# EAGLE design memext (EAGLE 6.1)
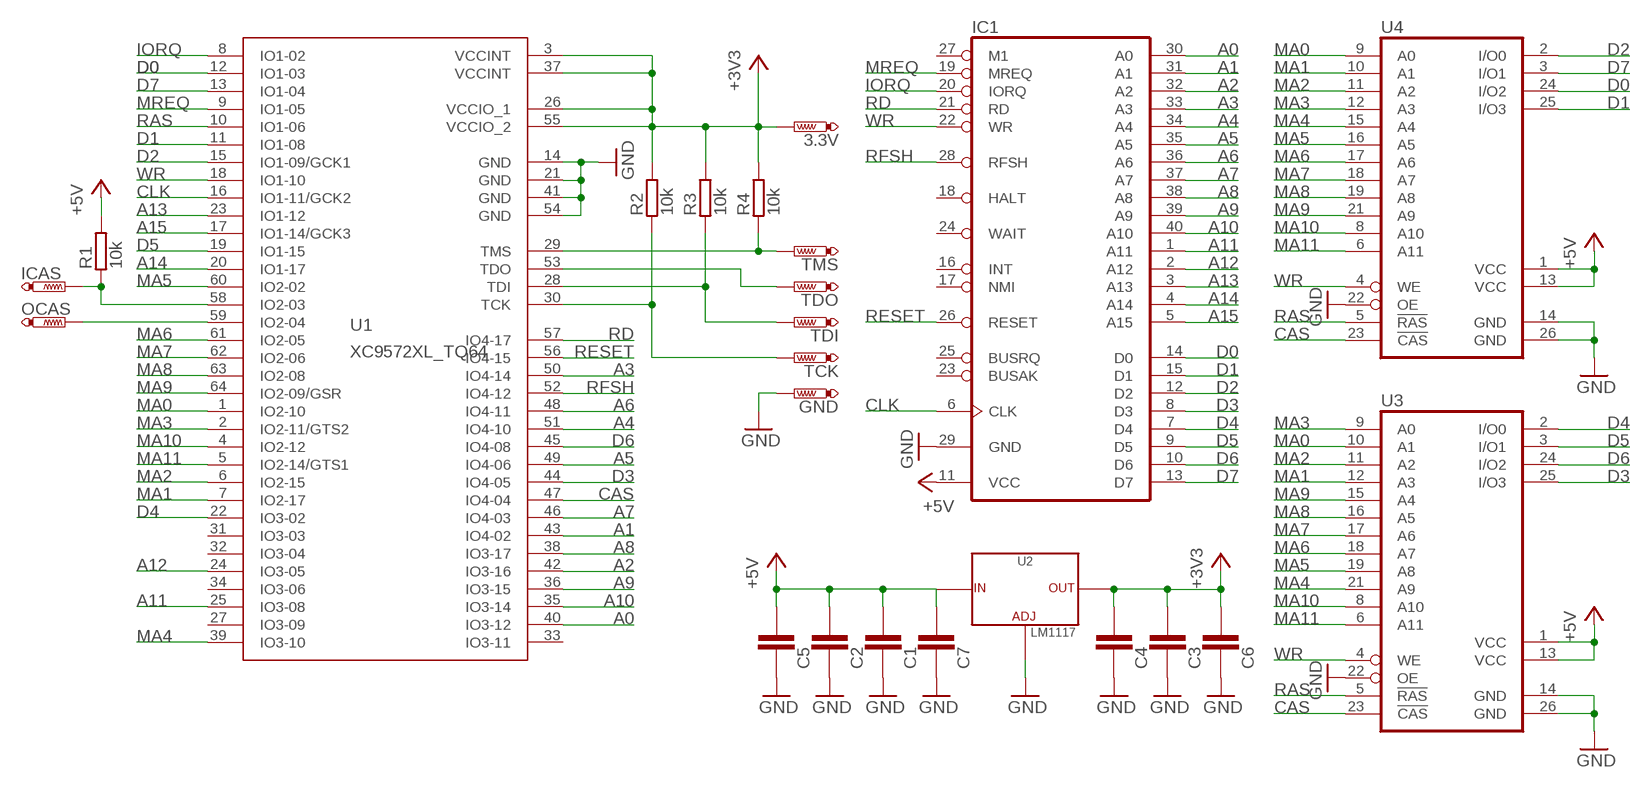
[diagram p0: schematic, sheet 1]

## Parts
3.3V  PTR1TP15SQ  [TP15SQ]
C1  KONDENZATORYC0603  [0603]
C2  KONDENZATORYC0603  [0603]
C3  KONDENZATORYC0603  [0603]
C4  KONDENZATORYC0603  [0603]
C5  KONDENZATORYC0603  [0603]
C6  KONDENZATORYC0603  [0603]
C7  KONDENZATORYC0603  [0603]
GND  PTR1TP15SQ  [TP15SQ]
IC1  Z80CPU  [DIL40]
ICAS  PTR1TP15SQ  [TP15SQ]
OCAS  PTR1TP15SQ  [TP15SQ]
R1  10k  ODPORYR0603  [0603]
R2  10k  ODPORYR0603  [0603]
R3  10k  ODPORYR0603  [0603]
R4  10k  ODPORYR0603  [0603]
TCK  PTR1TP15SQ  [TP15SQ]
TDI  PTR1TP15SQ  [TP15SQ]
TDO  PTR1TP15SQ  [TP15SQ]
TMS  PTR1TP15SQ  [TP15SQ]
U1  XC9572XL_TQ64  [TQ-64]
U2  LM1117  [SOT-223]
U3  DRAM4X4  [SOJ26-24]
U4  DRAM4X4  [SOJ26-24]

## Nets
+3V3: 3.3V.TP C3.2 C4.2 C6.2 R2.2 R3.2 R4.2 U1.3(VCCINT) U1.26(VCCIO_1) U1.37(VCCINT) U1.55(VCCIO_2) U2.2(OUT) U2.4(OUT)
+5V: C1.2 C2.2 C5.2 C7.2 IC1.11(VCC) R1.2 U2.3(IN) U3.1(VCC) U3.13(VCC) U4.1(VCC) U4.13(VCC)
A0: IC1.30(A0) U1.40(IO3-12)
A1: IC1.31(A1) U1.43(IO4-02)
A2: IC1.32(A2) U1.42(IO3-16)
A3: IC1.33(A3) U1.50(IO4-14)
A4: IC1.34(A4) U1.51(IO4-10)
A5: IC1.35(A5) U1.49(IO4-06)
A6: IC1.36(A6) U1.48(IO4-11)
A7: IC1.37(A7) U1.46(IO4-03)
A8: IC1.38(A8) U1.38(IO3-17)
A9: IC1.39(A9) U1.36(IO3-15)
A10: IC1.40(A10) U1.35(IO3-14)
A11: IC1.1(A11) U1.25(IO3-08)
A12: IC1.2(A12) U1.24(IO3-05)
A13: IC1.3(A13) U1.23(IO1-12)
A14: IC1.4(A14) U1.20(IO1-17)
A15: IC1.5(A15) U1.17(IO1-14/GCK3)
CAS: U1.47(IO4-04) U3.23(!CAS) U4.23(!CAS)
CLK: IC1.6(CLK) U1.16(IO1-11/GCK2)
D0: IC1.14(D0) U1.12(IO1-03) U4.24(I/O2)
D1: IC1.15(D1) U1.11(IO1-08) U4.25(I/O3)
D2: IC1.12(D2) U1.15(IO1-09/GCK1) U4.2(I/O0)
D3: IC1.8(D3) U1.44(IO4-05) U3.25(I/O3)
D4: IC1.7(D4) U1.22(IO3-02) U3.2(I/O0)
D5: IC1.9(D5) U1.19(IO1-15) U3.3(I/O1)
D6: IC1.10(D6) U1.45(IO4-08) U3.24(I/O2)
D7: IC1.13(D7) U1.13(IO1-04) U4.3(I/O1)
GND: C1.1 C2.1 C3.1 C4.1 C5.1 C6.1 C7.1 GND.TP IC1.29(GND) U1.14(GND) U1.21(GND) U1.41(GND) U1.54(GND) U2.1(ADJ) U3.14(GND) U3.22(OE) U3.26(GND) U4.14(GND) U4.22(OE) U4.26(GND)
IORQ: IC1.20(IORQ) U1.8(IO1-02)
MA0: U1.1(IO2-10) U3.10(A1) U4.9(A0)
MA1: U1.7(IO2-17) U3.12(A3) U4.10(A1)
MA2: U1.6(IO2-15) U3.11(A2) U4.11(A2)
MA3: U1.2(IO2-11/GTS2) U3.9(A0) U4.12(A3)
MA4: U1.39(IO3-10) U3.21(A9) U4.15(A4)
MA5: U1.60(IO2-02) U3.19(A8) U4.16(A5)
MA6: U1.61(IO2-05) U3.18(A7) U4.17(A6)
MA7: U1.62(IO2-06) U3.17(A6) U4.18(A7)
MA8: U1.63(IO2-08) U3.16(A5) U4.19(A8)
MA9: U1.64(IO2-09/GSR) U3.15(A4) U4.21(A9)
MA10: U1.4(IO2-12) U3.8(A10) U4.8(A10)
MA11: U1.5(IO2-14/GTS1) U3.6(A11) U4.6(A11)
MREQ: IC1.19(MREQ) U1.9(IO1-05)
N$1: R4.1 TMS.TP U1.29(TMS)
N$2: TDO.TP U1.53(TDO)
N$3: R3.1 TDI.TP U1.28(TDI)
N$4: R2.1 TCK.TP U1.30(TCK)
RAS: U1.10(IO1-06) U3.5(!RAS) U4.5(!RAS)
RD: IC1.21(RD) U1.57(IO4-17)
RESET: IC1.26(RESET) U1.56(IO4-15)
RFSH: IC1.28(RFSH) U1.52(IO4-12)
TP1: ICAS.TP R1.1 U1.58(IO2-03)
TP2: OCAS.TP U1.59(IO2-04)
WR: IC1.22(WR) U1.18(IO1-10) U3.4(WE) U4.4(WE)
Unconnected: IC1.16(INT) IC1.17(NMI) IC1.18(HALT) IC1.23(BUSAK) IC1.24(WAIT) IC1.25(BUSRQ) IC1.27(M1) U1.27(IO3-09) U1.31(IO3-03) U1.32(IO3-04) U1.33(IO3-11) U1.34(IO3-06)

## Library data of the parts
3.3V GND ICAS OCAS TCK TDI TDO TMS = testpad:PTR1: TEST PIN
C1-C7 = RCL:KONDENZATORY: Capacitor in package 0603 01005 (0402 metric): 0.4 × 0.2 mm (0.016 × 0.0079 in). 0.031 watt 0201 (0603 metric): 0.6 × 0.3 mm (0.024 × 0.012 in). 0.05 watt 0402 (1005 metric): 1.0 × 0.5 mm (0.039 × 0.020 in). 0.062 watt 0603 (1608 metric): 1.6 × 0.8 mm (0.063 × 0.031 in). 0.1 watt 0805 (2012 metric): 2.0 × 1.25 mm (0.079 × 0.049 in). 0.125 watt 1206 (3216 metric): 3.2 × 1.6 mm (0.13 × 0.063 in). 0.25 watt 1210 (3225 metric): 3.2 × 2.5 mm (0.13 × 0.098 in). 0.5 watt 1812 (4532 metric): 4.5 × 3.2 mm (0.18 × 0.13 in). 0.75 watt 2010 (5025 metric): 5.0 × 2.5 mm (0.20 × 0.098 in). 0.75 watt 2512 (6432 metric): 6.4 × 3.2 mm (0.25 × 0.13 in). 1 watt
IC1 = memext:Z80CPU: Z80 FAMILY DEVICE
R1-R4 = RCL:ODPORY: Resistor
U1 = memext:XC9572XL_TQ64
U2 = LM1117:LM1117: LDO
U3 U4 = memext:DRAM4X4: MEMORY; OC_FARNELL: unknown; OC_NEWARK: unknown

## Board
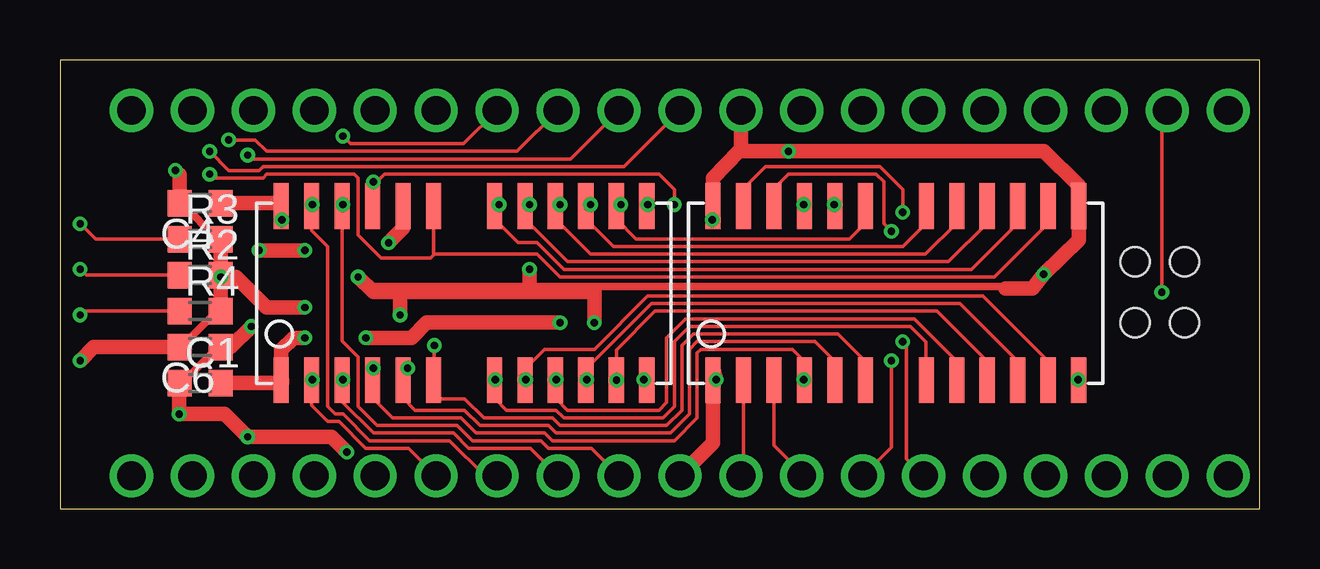
[diagram p1: board, top side]
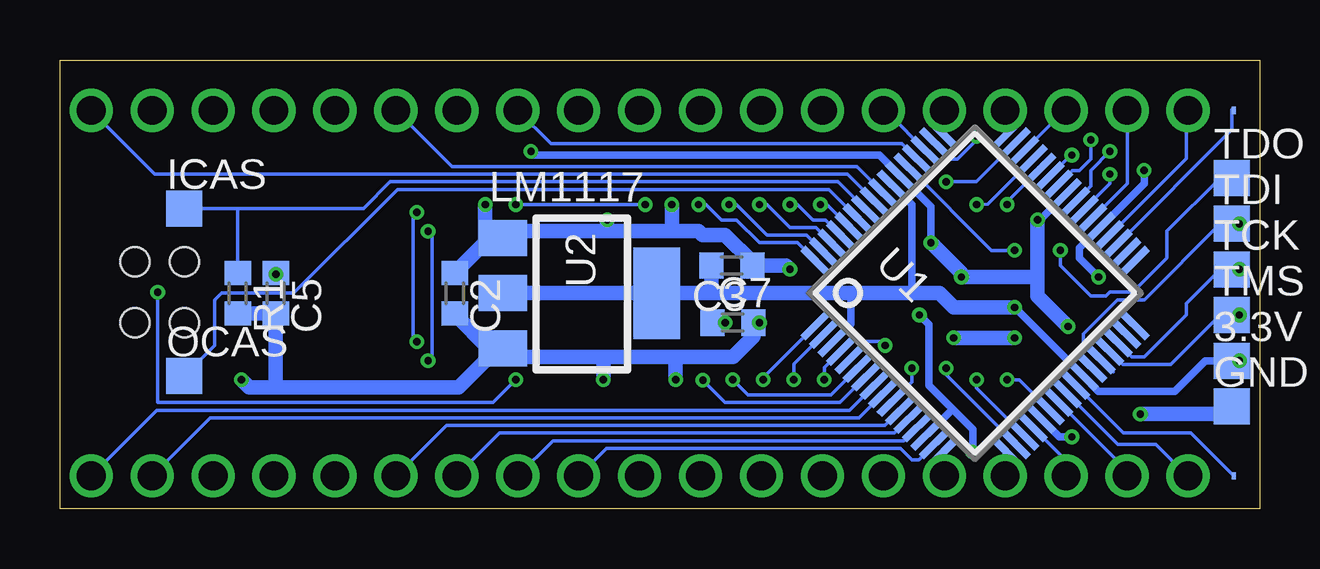
[diagram p2: board, bottom side, seen from below]

Size 50 x 18.73 mm. Coordinates in mm from the lower left corner, seen from the top.
Outline: 0,0 50,0 50,18.73 0,18.73 0,0
Copper layers (1*16): Top 0.035mm / dielectric 1.5mm / Bottom 0.035mm
Design rules: minimum track width 6mil, minimum drill 12mil, track to track 6mil, track to pad 6mil, pad to pad 6mil, via to via 6mil, smd to smd 0mil, copper to edge 10mil, drill to drill 10mil, minimum pad ring 10mil, minimum via ring 6mil, stop-mask expansion 2mil, vias tented up to drill 100mil, thermal gap 10mil
Holes 1.2 mm at 46.88,7.77 44.81,7.77 44.81,10.31 46.88,10.31

### Footprints (pad centres in the part's own frame; a part is rotated, then mirrored left to right if it is on the bottom)
TP15SQ = smd 1.5 x 1.5: TP 0,0
0603 = smd 1 x 1.1: 1 -0.85,0; 2 0.85,0
DIL40 = smd 0.152 x 0.305 bottom: 1 -24.765,-7.62; 40 -24.765,7.62 | drill 1.2: 2 -22.86,-7.62; 3 -20.32,-7.62; 4 -17.78,-7.62; 5 -15.24,-7.62; 6 -12.7,-7.62; 7 -10.16,-7.62; 8 -7.62,-7.62; 9 -5.08,-7.62; 10 -2.54,-7.62; 11 0,-7.62; 12 2.54,-7.62; 13 5.08,-7.62; 14 7.62,-7.62; 15 10.16,-7.62; 16 12.7,-7.62; 17 15.24,-7.62; 18 17.78,-7.62; 19 20.32,-7.62; 20 22.86,-7.62; 21 22.86,7.62; 22 20.32,7.62; 23 17.78,7.62; 24 15.24,7.62; 25 12.7,7.62; 26 10.16,7.62; 27 7.62,7.62; 28 5.08,7.62; 29 2.54,7.62; 30 0,7.62; 31 -2.54,7.62; 32 -5.08,7.62; 33 -7.62,7.62; 34 -10.16,7.62; 35 -12.7,7.62; 36 -15.24,7.62; 37 -17.78,7.62; 38 -20.32,7.62; 39 -22.86,7.62
TQ-64 = smd 0.3 x 1.6: 1 -3.75,-5.6; 2 -3.25,-5.6; 3 -2.75,-5.6; 4 -2.25,-5.6; 5 -1.75,-5.6; 6 -1.25,-5.6; 7 -0.75,-5.6; 8 -0.25,-5.6; 9 0.25,-5.6; 10 0.75,-5.6; 11 1.25,-5.6; 12 1.75,-5.6; 13 2.25,-5.6; 14 2.75,-5.6; 15 3.25,-5.6; 16 3.75,-5.6; 33 3.75,5.6; 34 3.25,5.6; 35 2.75,5.6; 36 2.25,5.6; 37 1.75,5.6; 38 1.25,5.6; 39 0.75,5.6; 40 0.25,5.6; 41 -0.25,5.6; 42 -0.75,5.6; 43 -1.25,5.6; 44 -1.75,5.6; 45 -2.25,5.6; 46 -2.75,5.6; 47 -3.25,5.6; 48 -3.75,5.6 | smd 1.6 x 0.3: 17 5.6,-3.75; 18 5.6,-3.25; 19 5.6,-2.75; 20 5.6,-2.25; 21 5.6,-1.75; 22 5.6,-1.25; 23 5.6,-0.75; 24 5.6,-0.25; 25 5.6,0.25; 26 5.6,0.75; 27 5.6,1.25; 28 5.6,1.75; 29 5.6,2.25; 30 5.6,2.75; 31 5.6,3.25; 32 5.6,3.75; 49 -5.6,3.75; 50 -5.6,3.25; 51 -5.6,2.75; 52 -5.6,2.25; 53 -5.6,1.75; 54 -5.6,1.25; 55 -5.6,0.75; 56 -5.6,0.25; 57 -5.6,-0.25; 58 -5.6,-0.75; 59 -5.6,-1.25; 60 -5.6,-1.75; 61 -5.6,-2.25; 62 -5.6,-2.75; 63 -5.6,-3.25; 64 -5.6,-3.75
SOT-223 = smd 1.499 x 2.007: 1 -2.3,-3.235; 2 0,-3.235; 3 2.3,-3.235 | smd 3.81 x 1.93: 4 0,3.175
SOJ26-24 = smd 0.635 x 1.905: 1 -7.62,-3.632; 2 -6.35,-3.632; 3 -5.08,-3.632; 4 -3.81,-3.632; 5 -2.54,-3.632; 6 -1.27,-3.632; 8 1.27,-3.632; 9 2.54,-3.632; 10 3.81,-3.632; 11 5.08,-3.632; 12 6.35,-3.632; 13 7.62,-3.632; 14 7.62,3.632; 15 6.35,3.632; 16 5.08,3.632; 17 3.81,3.632; 18 2.54,3.632; 19 1.27,3.632; 21 -1.27,3.632; 22 -2.54,3.632; 23 -3.81,3.632; 24 -5.08,3.632; 25 -6.35,3.632; 26 -7.62,3.632

### Placement (x,y rotation side)
3.3V  1.16,6.18 0 bottom
C1  5.84,5.25 0 top
C2  33.54,9 270 bottom
C3  22,10.15 180 bottom
C4  5.84,12.75 180 top
C5  41,9 270 bottom
C6  5.84,6.75 180 top
C7  21.95,7.77 0 bottom
GND  1.16,4.28 0 bottom
IC1  25.84,9 0 top
ICAS  44.81,12.53 0 bottom
OCAS  44.81,5.55 0 bottom
R1  42.59,9 270 bottom
R2  5.84,9.75 0 top
R3  5.84,11.25 0 top
R4  5.84,8.25 0 top
TCK  1.16,9.99 0 bottom
TDI  1.16,11.9 0 bottom
TDO  1.16,13.8 0 bottom
TMS  1.16,8.09 0 bottom
U1  11.86,9 315 bottom
U2  28.3,9 270 bottom
U3  16.84,9 0 top
U4  34.84,9 0 top

### Tracks (layer width: path | path; a pad name or v marks a point on that pad's centre or on a via)
+3V3  (via drill 0.3)
  Top 0.305: 6.71,11.26 6.55,11.26 5.07,12.75 C4.2 | R4.2 6.56,8.25 5.06,6.75 C6.2 | R2.2 6.69,9.7 v6.71,9.68
  Top 0.61: R3.2 R2.2 R4.2 | v10.21,8.41 8.62,8.41 7.35,9.68 v6.71,9.68 | C6.2 1.41,6.75 v0.84,6.18 | C4.2 4.99,13.94 v4.81,14.12
  Bottom 0.152: v0.84,6.18 3.3V.TP
  Bottom 0.305: v10.21,8.41 U1.26 6.71,4.91 3.54,4.91 2.27,6.18 v0.84,6.18 | v10.21,8.41 | v4.81,14.12 4.81,13.58 U1.37 7.51,10.88 7.51,10.47 v6.71,9.68 | U1.55 14.49,12.69 14.49,9 | U1.3 17.03,7.72 17.03,9
  Bottom 0.61: 22.84,9 U2.4 U2.2 | 22.84,9 17.03,9 14.49,9 13.34,9 12.75,8.41 v10.21,8.41 | C3.2 22.84,9
+5V  (via drill 0.3)
  Top 0.152: U3.13 24.48,5.39 v24.34,5.39 | U4.13 v42.43,5.39
  Top 0.61: IC1.11 27.22,2.76 U4.1 27.22,5.84 v27.35,5.39 | v20.84,7.77 15.29,7.77 14.65,7.14 v12.75,7.14 | C1.2 9.25,5.25 9.25,5.39 9.23,5.37 U3.1 9.22,6.63 9.73,7.14 v10.21,7.14
  Bottom 0.61: 31.8,6.34 32.11,6.34 33.38,5.07 41,5.07 | 31.8,6.34 27.35,6.34 | 27.35,6.34 24.34,6.34 | 24.34,6.34 21.95,6.34 21.1,7.19 C7.2 v20.84,7.77 | v24.34,5.39 24.34,6.34 | v27.35,5.39 27.35,6.34 | 41,5.07 42.12,5.07 v42.43,5.39 | 41,5.07 C5.2 42.53,8.15 42.59,8.09 R1.2 | 31.8,6.34 31.54,6.6 U2.3 31.64,6.66 32.11,6.66 C2.2 | v10.21,7.14 v12.75,7.14
A0  (via drill 0.3)
  Top 0.152: IC1.30 23.5,14.28 8.46,14.28 8.3,14.12 7.03,14.12 v6.24,14.91
  Bottom 0.152: U1.40 7.03,13.48 7.03,14.12 v6.24,14.91
A1  (via drill 0.3)
  Top 0.152: IC1.31 21.28,14.6 7.98,14.6 v7.83,14.76
  Bottom 0.152: U1.43 7.87,14.76 v7.83,14.76
A2  (via drill 0.3)
  Top 0.152: IC1.32 19.05,14.91 8.62,14.91 8.14,15.39 v7.03,15.39
  Bottom 0.152: U1.42 7.8,14.12 7.51,14.12 7.03,14.6 v7.03,15.39
A3  (via drill 0.3)
  Top 0.152: IC1.33 16.83,15.23 12.11,15.23 v11.79,15.55
  Bottom 0.152: U1.50 12.86,14.6 12.59,14.6 11.79,15.39 v11.79,15.55
A4
  Bottom 0.152: U1.51 15.47,16.5 15.6,16.5 15.68,16.58 IC1.34
A5
  Bottom 0.152: U1.49 13.22,15.61 13.22,16.62 IC1.35
A6
  Bottom 0.152: U1.48 10.52,15.61 10.52,16.62 IC1.36
A7
  Bottom 0.152: U1.46 8.41,16.34 8.14,16.34 8.06,16.43 IC1.37
A8
  Bottom 0.152: U1.38 5.52,13.57 IC1.38
A9
  Bottom 0.152: U1.36 3.06,14.62 3.06,16.54 IC1.39
A10
  Bottom 0.152: U1.35 1.16,15.81 1.16,16.66 1.12,16.66 IC1.40
A11
  Bottom 0.152: U1.25 5.67,3.17 2.86,3.17 IC1.1
A12
  Bottom 0.152: U1.24 5.91,2.69 4.33,2.69 3.02,1.38 IC1.2
A13
  Bottom 0.152: U1.23 5.6,1.68 5.6,1.42 5.56,1.42 IC1.3
A14
  Bottom 0.152: U1.20 8.14,2.1 8.14,1.46 IC1.4
A15
  Bottom 0.152: U1.17 10.68,2.26 10.68,1.46 IC1.5
CAS  (via drill 0.3)
  Top 0.152: U3.23 13.06,12.67 v13.06,13.64 13.22,13.64 13.54,13.96 24.97,13.96 25.61,13.33 v25.61,12.69 | U4.23 31.03,12.66 v31,12.69
  Bottom 0.152: v25.61,12.69 v31,12.69 | U1.47 11.81,13.64 v13.06,13.64
CLK
  Bottom 0.152: U1.16 13.14,2.36 IC1.6
D0  (via drill 0.3)
  Top 0.152: U4.24 29.76,13.36 30.37,13.96 34.02,13.96 34.34,13.64 34.34,11.9 v34.65,11.58 | IC1.14 34.65,2.57 v34.65,6.18
  Bottom 0.152: U1.12 15.22,3.17 31.67,3.17 IC1.14 | v34.65,6.18 34.5,6.34 34.5,11.42 v34.65,11.58
D1  (via drill 0.3)
  Top 0.152: U4.25 28.49,13.36 29.41,14.28 34.18,14.28 35.13,13.33 v35.13,12.38 | v35.13,6.98 35.29,6.98 35.29,2.09 IC1.15
  Bottom 0.152: U1.11 15.61,3.49 33.9,3.49 IC1.15 | v35.13,12.38 35.29,12.38 35.29,6.98 v35.13,6.98
D2
  Top 0.152: U4.2 28.49,1.77 28.38,1.66 IC1.12
  Bottom 0.152: U1.15 14.21,2.06 14.49,2.06 14.97,2.53 27.23,2.53 IC1.12
D3  (via drill 0.3)
  Top 0.152: IC1.8 17.71,1.38 16.24,2.85 12.9,2.85 11.79,3.96 11.48,3.96 11.16,4.28 11.16,10.95 10.49,11.62 U3.25 10.52,12.67 v10.52,12.69
  Bottom 0.152: U1.44 10.64,12.69 v10.52,12.69
D4  (via drill 0.3)
  Top 0.152: IC1.7 14.53,2.53 12.75,2.53 11.63,3.64 11.16,3.64 10.49,4.31 U3.2 10.5,5.37 v10.52,5.39
  Bottom 0.152: U1.22 10.02,5.39 v10.52,5.39
D5  (via drill 0.3)
  Top 0.152: v11.79,5.39 v11.78,5.39 U3.3 11.76,4.47 13.06,3.17 16.4,3.17 17.03,2.53 19.61,2.53 IC1.9
  Bottom 0.152: U1.19 11.79,5.04 v11.79,5.39
D6  (via drill 0.3)
  Top 0.152: IC1.10 22.15,2.53 20.37,2.53 20.05,2.85 17.19,2.85 16.56,3.49 13.22,3.49 12.43,4.28 12.43,6.34 11.76,7.01 U3.24 11.76,12.66 v11.79,12.69
  Bottom 0.152: U1.45 11.32,12.72 v11.79,12.69
D7
  Top 0.152: U4.3 29.76,2.66 30.92,1.5 IC1.13
  Bottom 0.152: U1.13 14.83,2.85 27.67,2.85 27.79,2.85 29.45,2.85 IC1.13
GND  (via drill 0.3)
  Top 0.152: U4.22 32.27,12.66 | U3.14 24.49,12.67 v24.49,12.69 | 40.53,9.2 40.69,9.2 40.69,9.3 | 40.69,9.3 40.85,9.36 19.57,9.36 12.9,9.36 | 14.02,9.3 40.69,9.3 | 39.42,9.2 22.59,9.2 22.27,9.04 | U3.26 9.25,12.6 v9.25,12.06
  Top 0.305: C1.1 5.37,5.63 5.46,5.63 6.24,6.4 6.34,6.4 C6.1
  Top 0.61: U4.22 v32.27,12.69 | U3.22 14.3,11.71 v13.7,11.11 | v12.43,9.68 13.06,9.04 14.18,9.04 | 14.18,9.04 22.27,9.04 v22.27,7.77 | 28.38,14.91 28.3,14.91 27.22,13.8 U4.26 27.22,12.06 v27.19,12.06 | 28.38,14.91 v30.37,14.91 41,14.91 42.46,13.49 U4.14 42.46,11.22 v41,9.79 40.53,9.2 39.42,9.2 | IC1.29 28.38,14.91 | v19.57,9.99 19.57,9.36 | C4.1 9.22,12.75 U3.26 | v7.98,7.61 7.12,6.75 C6.1 | C1.1 4.97,5.23 v4.97,3.96 6.87,3.96 v7.83,3.01 11.32,3.01 v11.95,2.37 | v14.18,8.09 14.18,9.04
  Bottom 0.305: v30.37,14.91 30.21,14.76 15.85,14.76 U1.54 13.7,12.61 v13.7,11.11 | U1.21 8.34,3.01 v7.83,3.01 | U1.41 9.16,12.06 v9.25,12.06 | v14.18,8.09 13.79,7.7 13.79,5.16 12.75,4.12 | 12.75,4.12 11.95,3.33 v11.95,2.37 | U1.14 12.85,4.12 12.75,4.12
  Bottom 0.61: v32.27,12.69 32.27,11.26 | 32.27,11.26 32.27,11.12 C2.1 | 32.27,11.26 32.24,11.3 U2.1 31.26,11.58 27.19,11.58 | v13.7,11.11 12.43,9.84 v12.43,9.68 9.25,9.68 | v22.27,7.77 C7.1 22.43,7.77 | v24.49,12.69 24.49,11.58 | 24.49,11.58 27.19,11.58 | 27.19,11.58 v27.19,12.06 27.19,11.74 | v41,9.79 C5.1 | v9.25,12.06 9.25,9.68 | 9.25,9.68 9.25,8.88 v7.98,7.61 | C3.1 21.14,10.3 22.27,11.42 23.22,11.42 23.38,11.58 24.49,11.58 | v19.57,9.99 19.73,10.15 21.16,10.15 | v4.97,3.96 1.16,3.96 GND.TP
IORQ
  Bottom 0.152: U1.8 17.09,4.12 45.96,4.12 IC1.20
MA0  (via drill 0.3)
  Top 0.152: v20.67,5.39 v20.68,5.39 20.66,5.37 U3.10 20.65,4.63 21.16,4.12 24.97,4.12 25.29,4.44 25.29,7.14 26.08,7.93 35.61,7.93 37.38,6.16 U4.9
  Bottom 0.152: U1.1 20.68,5.48 v20.68,5.39
MA1  (via drill 0.3)
  Top 0.152: U4.10 38.65,6.16 36.56,8.25 24.81,8.25 23.19,6.63 U3.12 v23.2,5.37
  Bottom 0.152: v23.2,5.37 22.27,4.44 17.48,4.44 U1.7
MA2  (via drill 0.3)
  Top 0.152: v21.95,5.39 v21.94,5.39 U3.11 21.92,5.83 24.65,8.56 37.51,8.56 39.92,6.16 U4.11
  Bottom 0.152: v21.95,5.39 21.32,4.76 17.87,4.76 U1.6
MA3  (via drill 0.3)
  Top 0.152: v19.41,5.39 v19.4,5.39 U3.9 19.38,5.83 20.21,6.66 22.27,6.66 24.49,8.88 38.46,8.88 41.19,6.16 U4.12
  Bottom 0.152: U1.2 19.41,6.04 v19.41,5.39
MA4  (via drill 0.3)
  Top 0.152: U4.15 41.19,11.93 38.94,9.68 20.84,9.68 19.89,10.63 15.6,10.63 15.57,10.6 | v6.24,13.96 6.24,13.8 8.46,13.8 8.62,13.96 12.27,13.96 12.43,13.8 12.43,11.42 13.38,10.47 15.45,10.47 15.57,10.6 | U3.21 15.57,10.6
  Bottom 0.152: U1.39 6.24,13.56 v6.24,13.96
MA5  (via drill 0.3)
  Top 0.152: U4.16 39.92,11.93 37.99,9.99 21,9.99 19.89,11.11 19.1,11.11 18.11,12.09 U3.19 18.14,12.67 18.14,12.69 v18.3,12.69
  Bottom 0.152: U1.60 18.03,12.69 v18.3,12.69
MA6  (via drill 0.3)
  Top 0.152: U4.17 38.65,11.93 37.04,10.31 21.16,10.31 19.38,12.09 U3.18 19.41,12.67 v19.57,12.69
  Bottom 0.152: U1.61 18.1,12.06 18.62,12.06 19.25,12.69 v19.57,12.69
MA7  (via drill 0.3)
  Top 0.152: U4.18 37.38,11.93 36.08,10.63 22.11,10.63 20.65,12.09 U3.17 20.59,12.63 v20.84,12.69
  Bottom 0.152: U1.62 18.49,11.74 19.57,11.74 20.52,12.69 v20.84,12.69
MA8  (via drill 0.3)
  Top 0.152: v22.11,12.69 21.79,12.6 U3.16 21.92,12.09 23.07,10.95 35.13,10.95 36.11,11.93 U4.19
  Bottom 0.152: U1.63 18.88,11.42 20.52,11.42 21.79,12.69 v22.11,12.69
MA9  (via drill 0.3)
  Top 0.152: U4.21 33.57,11.93 32.91,11.26 24.02,11.26 23.19,12.09 U3.15 23.13,12.69 v23.38,12.69
  Bottom 0.152: U1.64 19.27,11.11 20.84,11.11 21.79,12.06 22.43,12.06 23.07,12.69 v23.38,12.69
MA10  (via drill 0.3)
  Top 0.152: v18.14,5.39 v18.13,5.39 U3.8 18.11,4.63 18.62,4.12 20.68,4.12 21,3.8 25.13,3.8 25.61,4.28 25.61,6.98 26.24,7.61 35.45,7.61 36.09,6.97 36.09,5.39 U4.8
  Bottom 0.152: U1.4 18.14,5.9 v18.14,5.39
MA11  (via drill 0.3)
  Top 0.152: U4.6 33.57,6.16 32.43,7.29 26.4,7.29 25.92,6.82 25.92,4.12 25.29,3.49 20.84,3.49 20.52,3.8 17.67,3.8 16.87,4.6 15.6,4.6 15.57,4.63 U3.6 15.6,5.4 v15.6,6.82
  Bottom 0.152: U1.5 16.36,6.98 15.76,6.98 v15.6,6.82
MREQ
  Bottom 0.152: U1.9 16.7,3.8 38.78,3.8 38.82,3.8 43.74,3.8 IC1.19
N$1  (via drill 0.3)
  Top 0.152: R4.1 1,8.25 v0.84,8.09
  Bottom 0.152: U1.29 5.7,6.03 3.7,6.03 1.63,8.09 v0.84,8.09 TMS.TP
N$2  (via drill 0.3)
  Top 0.61: v8.3,10.79 v10.21,10.79
  Bottom 0.152: U1.53 11.17,10.79 v10.21,10.79 | TDO.TP 1.63,13.8 3.86,11.58 3.86,10.47 5.29,9.04 6.24,9.04 6.4,8.88 7.03,8.88 8.3,10.15 v8.3,10.79
N$3  (via drill 0.3)
  Top 0.152: R3.1 1.49,11.25 v0.84,11.9
  Bottom 0.152: 6.09,5.71 U1.28 7.35,6.96 7.35,7.29 5.92,8.72 4.81,8.72 1.63,11.9 v0.84,11.9 TDI.TP
N$4  (via drill 0.3)
  Top 0.152: R2.1 1.08,9.75 v0.84,9.99
  Bottom 0.152: U1.30 5.31,6.34 4.81,6.34 3.06,8.09 3.06,8.56 1.63,9.99 v0.84,9.99 TCK.TP
RAS  (via drill 0.3)
  Top 0.152: U4.5 32.3,6.16 31.48,6.98 26.56,6.98 26.24,6.66 26.24,3.96 25.45,3.17 20.68,3.17 20.37,3.49 17.51,3.49 16.87,4.12 14.81,4.12 14.3,4.63 U3.5 14.28,5.39 v14.49,5.87
  Bottom 0.152: U1.10 14.49,5.31 v14.49,5.87
RD
  Bottom 0.152: U1.57 17.18,13.96 46.04,13.96 IC1.21
RESET
  Bottom 0.152: U1.56 16.79,14.28 33.66,14.28 IC1.26
RFSH
  Bottom 0.152: U1.52 14.91,15.23 29.53,15.23 IC1.28
TP1
  Bottom 0.152: U1.58 17.57,13.64 36.24,13.64 37.35,12.53 42.59,12.53 | ICAS.TP 42.59,12.53 | R1.1 42.59,12.53
TP2
  Bottom 0.152: U1.59 17.95,13.33 35.92,13.33 40.25,9 43.27,9 43.54,8.72 43.54,6.82 OCAS.TP
WR  (via drill 0.3)
  Top 0.152: U4.4 31.03,6.16 30.53,6.66 26.72,6.66 26.56,6.5 26.56,3.8 25.61,2.85 20.52,2.85 20.21,3.17 17.35,3.17 16.71,3.8 13.86,3.8 13.03,4.63 U3.4 13.22,5.4 v13.06,5.87 | U4.4 31,5.34 | U4.4 v31.01,5.39 v31,5.39 | v45.93,9.04 45.93,16.34 46.16,16.58 IC1.22
  Bottom 0.152: v31,5.39 31.95,4.44 45.93,4.44 v45.93,9.04 | U1.18 13.06,5.61 v13.06,5.87

### Text on the board
tPotisk: 4MB | MEMEXT | SeC | 1
bPotisk: TDO | IN | TDI | TCK | CAS | TMS | 3.3V | OUT | GND